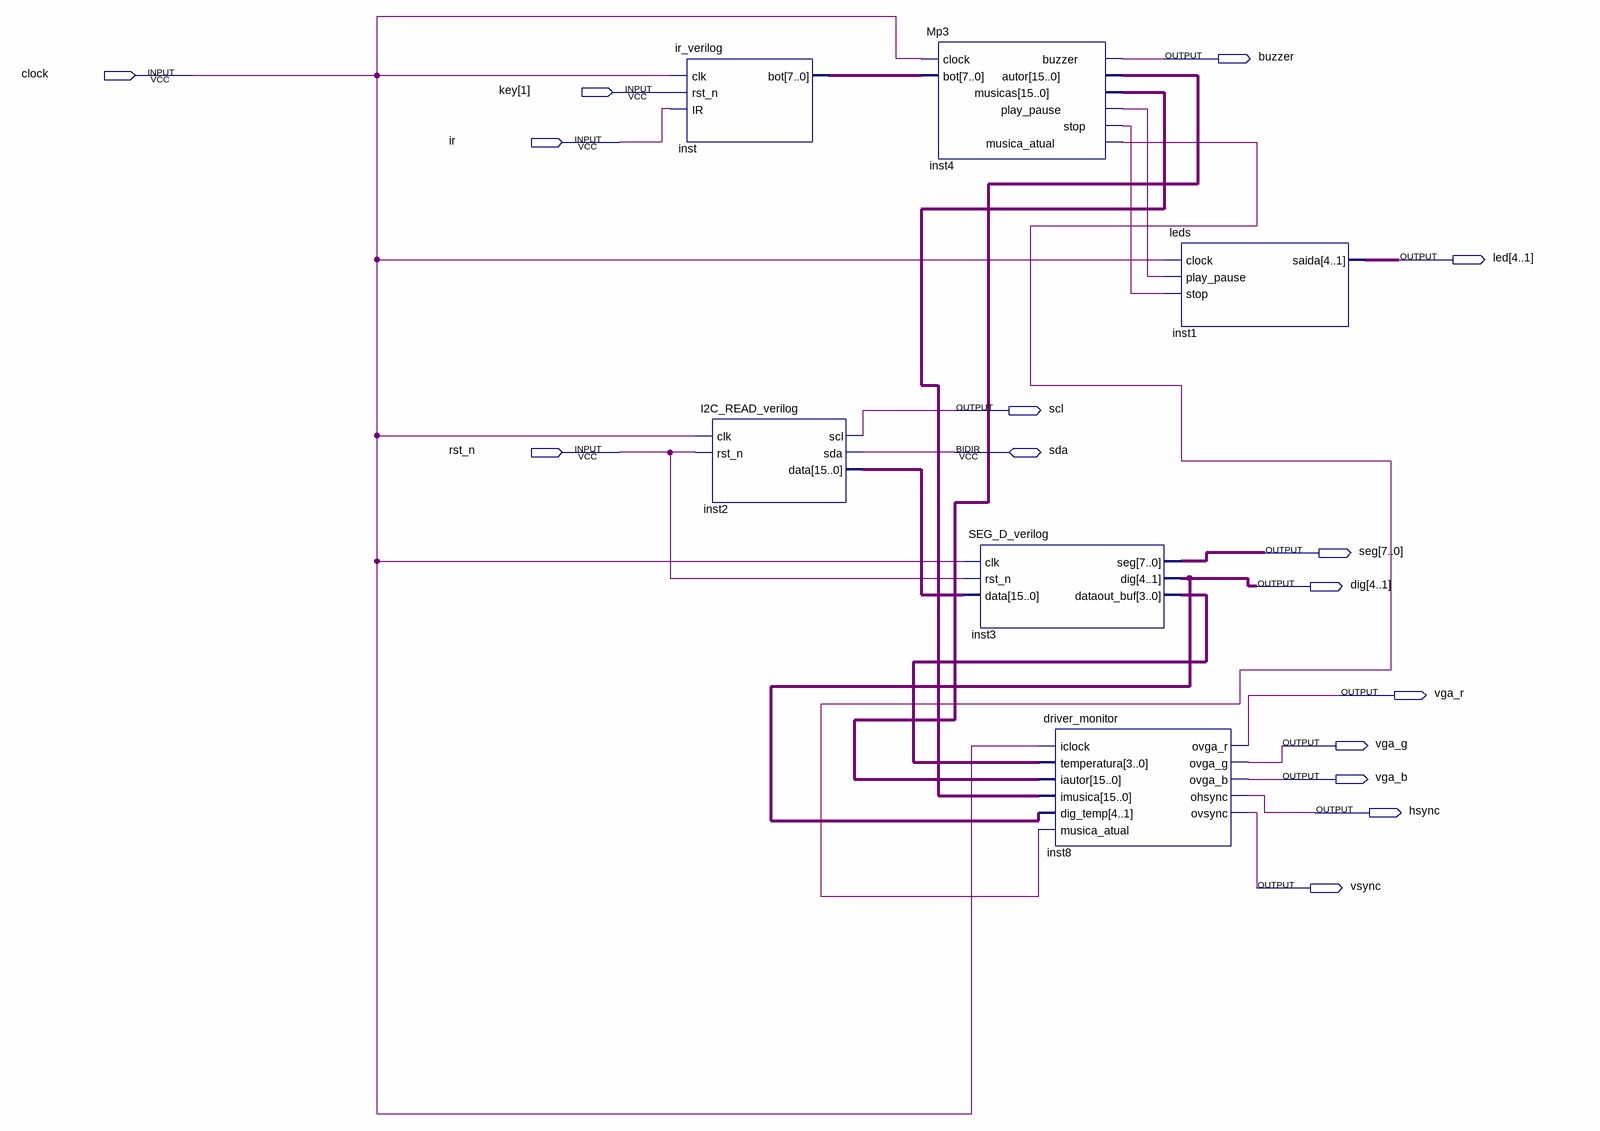
[diagram p0: schematic sheet]
// Quartus schematic top_entity.bdf as structural Verilog: 6 symbols, 15 pins
module top_entity (
  input  clock,
  input  [1:1] key,
  input  ir,
  input  rst_n,
  inout  sda,
  output buzzer,
  output [4:1] led,
  output scl,
  output [7:0] seg,
  output [4:1] dig,
  output vga_r,
  output vga_g,
  output vga_b,
  output hsync,
  output vsync
);

  wire inst4_musica_atual, inst4_play_pause, inst4_stop;
  wire [3:0] inst3_dataout_buf;
  wire [7:0] inst_bot;
  wire [15:0] inst2_data, inst4_autor, inst4_musicas;

  ir_verilog inst (.clk(clock), .rst_n(key[1]), .IR(ir), .bot(inst_bot));
  I2C_READ_verilog inst2 (.clk(clock), .rst_n(rst_n), .scl(scl), .data(inst2_data), .sda(sda));
  Mp3 inst4 (
    .clock(clock), .bot(inst_bot), .buzzer(buzzer), .autor(inst4_autor), .musicas(inst4_musicas),
    .play_pause(inst4_play_pause), .stop(inst4_stop), .musica_atual(inst4_musica_atual));
  SEG_D_verilog inst3 (
    .clk(clock), .rst_n(rst_n), .data(inst2_data), .seg(seg), .dig(dig), .dataout_buf(inst3_dataout_buf));
  driver_monitor inst8 (
    .iclock(clock), .temperatura(inst3_dataout_buf), .iautor(inst4_autor), .imusica(inst4_musicas),
    .dig_temp(dig), .musica_atual(inst4_musica_atual), .ovga_r(vga_r), .ovga_g(vga_g), .ovga_b(vga_b),
    .ohsync(hsync), .ovsync(vsync));
  leds inst1 (.clock(clock), .play_pause(inst4_play_pause), .stop(inst4_stop), .saida(led));
endmodule
